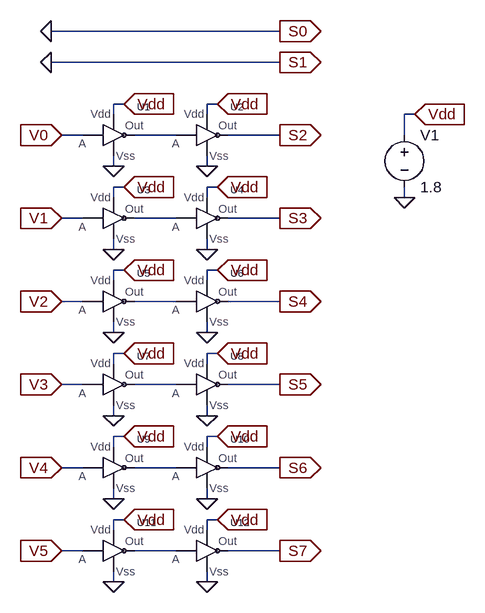
[diagram p0: schematic Shifter_Block.asc]
Shifter_Block.asc, the LTspice schematic file:
Version 4
SHEET 1 880 1128
WIRE 288 80 -64 80
WIRE 288 128 -64 128
WIRE 48 192 32 192
WIRE 192 192 176 192
WIRE 32 208 32 192
WIRE 176 208 176 192
WIRE 496 208 480 208
WIRE -16 240 -48 240
WIRE 128 240 64 240
WIRE 288 240 208 240
WIRE 480 240 480 208
WIRE 32 288 32 272
WIRE 176 288 176 272
WIRE 48 320 32 320
WIRE 192 320 176 320
WIRE 32 336 32 320
WIRE 176 336 176 320
WIRE 480 336 480 320
WIRE -16 368 -48 368
WIRE 128 368 64 368
WIRE 288 368 208 368
WIRE 32 416 32 400
WIRE 176 416 176 400
WIRE 48 448 32 448
WIRE 192 448 176 448
WIRE 32 464 32 448
WIRE 176 464 176 448
WIRE -16 496 -48 496
WIRE 128 496 64 496
WIRE 288 496 208 496
WIRE 32 544 32 528
WIRE 176 544 176 528
WIRE 48 576 32 576
WIRE 192 576 176 576
WIRE 32 592 32 576
WIRE 176 592 176 576
WIRE -16 624 -48 624
WIRE 128 624 64 624
WIRE 288 624 208 624
WIRE 32 672 32 656
WIRE 176 672 176 656
WIRE 48 704 32 704
WIRE 192 704 176 704
WIRE 32 720 32 704
WIRE 176 720 176 704
WIRE -16 752 -48 752
WIRE 128 752 64 752
WIRE 288 752 208 752
WIRE 32 800 32 784
WIRE 176 800 176 784
WIRE 48 832 32 832
WIRE 192 832 176 832
WIRE 32 848 32 832
WIRE 176 848 176 832
WIRE -16 880 -48 880
WIRE 128 880 64 880
WIRE 288 880 208 880
WIRE 32 928 32 912
WIRE 176 928 176 912
FLAG 288 80 S0
IOPIN 288 80 Out
FLAG -64 80 0
FLAG 288 128 S1
IOPIN 288 128 Out
FLAG -64 128 0
FLAG 288 240 S2
IOPIN 288 240 Out
FLAG 48 192 Vdd
IOPIN 48 192 In
FLAG 192 192 Vdd
IOPIN 192 192 In
FLAG 32 288 0
FLAG 176 288 0
FLAG -48 240 V0
IOPIN -48 240 In
FLAG 288 368 S3
IOPIN 288 368 Out
FLAG 48 320 Vdd
IOPIN 48 320 In
FLAG 192 320 Vdd
IOPIN 192 320 In
FLAG 32 416 0
FLAG 176 416 0
FLAG -48 368 V1
IOPIN -48 368 In
FLAG 288 496 S4
IOPIN 288 496 Out
FLAG 48 448 Vdd
IOPIN 48 448 In
FLAG 192 448 Vdd
IOPIN 192 448 In
FLAG 32 544 0
FLAG 176 544 0
FLAG -48 496 V2
IOPIN -48 496 In
FLAG 288 624 S5
IOPIN 288 624 Out
FLAG 48 576 Vdd
IOPIN 48 576 In
FLAG 192 576 Vdd
IOPIN 192 576 In
FLAG 32 672 0
FLAG 176 672 0
FLAG -48 624 V3
IOPIN -48 624 In
FLAG 288 752 S6
IOPIN 288 752 Out
FLAG 48 704 Vdd
IOPIN 48 704 In
FLAG 192 704 Vdd
IOPIN 192 704 In
FLAG 32 800 0
FLAG 176 800 0
FLAG -48 752 V4
IOPIN -48 752 In
FLAG 288 880 S7
IOPIN 288 880 Out
FLAG 48 832 Vdd
IOPIN 48 832 In
FLAG 192 832 Vdd
IOPIN 192 832 In
FLAG 32 928 0
FLAG 176 928 0
FLAG -48 880 V5
IOPIN -48 880 In
FLAG 480 336 0
FLAG 496 208 Vdd
IOPIN 496 208 In
SYMBOL NOT1 16 240 R0
SYMATTR InstName U1
SYMBOL NOT1 160 240 R0
SYMATTR InstName U2
SYMBOL NOT1 16 368 R0
SYMATTR InstName U3
SYMBOL NOT1 160 368 R0
SYMATTR InstName U4
SYMBOL NOT1 16 496 R0
SYMATTR InstName U5
SYMBOL NOT1 160 496 R0
SYMATTR InstName U6
SYMBOL NOT1 16 624 R0
SYMATTR InstName U7
SYMBOL NOT1 160 624 R0
SYMATTR InstName U8
SYMBOL NOT1 16 752 R0
SYMATTR InstName U9
SYMBOL NOT1 160 752 R0
SYMATTR InstName U10
SYMBOL NOT1 16 880 R0
SYMATTR InstName U11
SYMBOL NOT1 160 880 R0
SYMATTR InstName U12
SYMBOL voltage 480 224 R0
WINDOW 123 0 0 Left 0
WINDOW 39 0 0 Left 0
SYMATTR InstName V1
SYMATTR Value 1.8

The netlist it stands for:
* Shifter_Block.asc
XU1 Vdd 0 V0 N001 NOT1  ; pins Vdd Vss A Out
XU2 Vdd 0 N001 S2 NOT1  ; pins Vdd Vss A Out
XU3 Vdd 0 V1 N002 NOT1  ; pins Vdd Vss A Out
XU4 Vdd 0 N002 S3 NOT1  ; pins Vdd Vss A Out
XU5 Vdd 0 V2 N003 NOT1  ; pins Vdd Vss A Out
XU6 Vdd 0 N003 S4 NOT1  ; pins Vdd Vss A Out
XU7 Vdd 0 V3 N004 NOT1  ; pins Vdd Vss A Out
XU8 Vdd 0 N004 S5 NOT1  ; pins Vdd Vss A Out
XU9 Vdd 0 V4 N005 NOT1  ; pins Vdd Vss A Out
XU10 Vdd 0 N005 S6 NOT1  ; pins Vdd Vss A Out
XU11 Vdd 0 V5 N006 NOT1  ; pins Vdd Vss A Out
XU12 Vdd 0 N006 S7 NOT1  ; pins Vdd Vss A Out
V1 Vdd 0 1.8
.lib NOT1.sub
.backanno
.end